# Altium schematic sheet USB.SchDoc
size A4
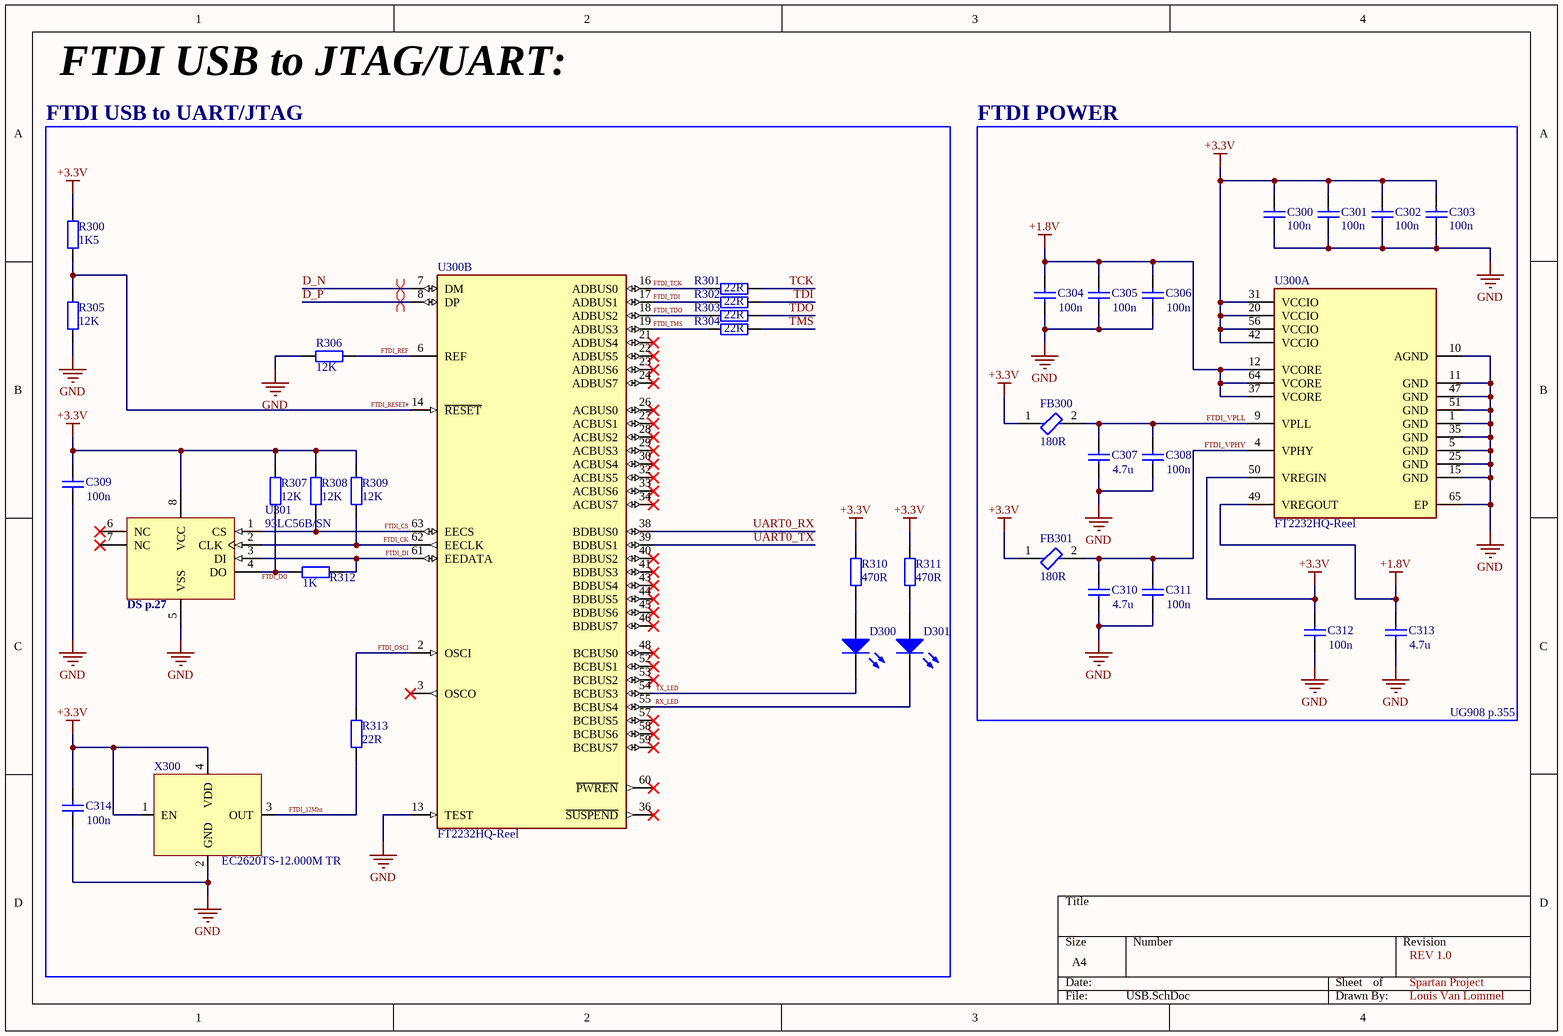
[diagram p0: USB.SchDoc]

## Parts
C300  100n  [CAP_0603]
C301  100n  [CAP_0603]
C302  100n  [CAP_0603]
C303  100n  [CAP_0603]
C304  100n  [CAP_0603]
C305  100n  [CAP_0603]
C306  100n  [CAP_0603]
C307  4.7u  [CAP_0603]
C308  100n  [CAP_0603]
C309  100n  [CAP_0603]
C310  4.7u  [CAP_0603]
C311  100n  [CAP_0603]
C312  100n  [CAP_0603]
C313  4.7u  [CAP_0603]
C314  100n  [CAP_0603]
D300  LED  [LED_0603]  (value not drawn)
D301  LED  [LED_0603]  (value not drawn)
FB300  180R  [CAP_0805]
FB301  180R  [CAP_0805]
R300  1K5  [RES_0603]
R301  value 22R  [RES_0603]  (hidden comment: 22)
R302  value 22R  [RES_0603]  (hidden comment: 22)
R303  value 22R  [RES_0603]  (hidden comment: 22)
R304  value 22R  [RES_0603]  (hidden comment: 22)
R305  12K  [RES_0603]
R306  12K  [RES_0603]
R307  12K  [RES_0603]
R308  12K  [RES_0603]
R309  12K  [RES_0603]
R310  value 470R  [RES_0603]  (hidden comment: 470)
R311  value 470R  [RES_0603]  (hidden comment: 470)
R312  1K  [RES_0603]
R313  value 22R  [RES_0603]  (hidden comment: 22)
U300  FT2232HQ-Reel  [FP-FT2232HQ-Reel-MFG]  (parts A,B of 2)
U301  93LC56B/SN  [SOIC8]
X300  EC2620TS-12.000M TR  [7x5mm Crystal]

## Blocks framed on the sheet
FTDI USB to UART/JTAG: C309 C314 D300 D301 R300-R313 U300 U301 X300
FTDI POWER: C300-C308 C310-C313 FB300 FB301 U300

## Nets
+1.8V: C304.2 C305.2 C306.2 C313.2 U300.12(VCORE) U300.37(VCORE) U300.49(VREGOUT) U300.64(VCORE)
+3.3V: C300.2 C301.2 C302.2 C303.2 C309.2 C312.2 C314.2 FB300.1 FB301.1 R300.2 R307.1 R308.1 R309.1 R310.2 R311.2 U300.20(VCCIO) U300.31(VCCIO) U300.42(VCCIO) U300.50(VREGIN) U300.56(VCCIO) U301.8(VCC) X300.1(EN) X300.4(VDD)
GND: C300.1 C301.1 C302.1 C303.1 C304.1 C305.1 C306.1 C307.1 C308.1 C309.1 C310.1 C311.1 C312.1 C313.1 C314.1 R305.1 R306.1 U300.1(GND) U300.5(GND) U300.10(AGND) U300.11(GND) U300.13(TEST) U300.15(GND) U300.25(GND) U300.35(GND) U300.47(GND) U300.51(GND) U300.65(EP) U301.5(VSS) X300.2(GND)
D_N: U300.7(DM)
D_P: U300.8(DP)
FTDI_12Mhz: R313.2 X300.3(OUT)
FTDI_CK: R309.2 U300.62(EECLK) U301.2(CLK)
FTDI_CS: R308.2 U300.63(EECS) U301.1(CS)
FTDI_DI: R312.1 U300.61(EEDATA) U301.3(DI)
FTDI_DO: R307.2 R312.2 U301.4(DO)
FTDI_OSCI: R313.1 U300.2(OSCI)
FTDI_REF: R306.2 U300.6(REF)
FTDI_RESET#: R300.1 R305.2 U300.14(~{RESET})
FTDI_TCK: R301.2 U300.16(ADBUS0)
FTDI_TDI: R302.2 U300.17(ADBUS1)
FTDI_TDO: R303.2 U300.18(ADBUS2)
FTDI_TMS: R304.2 U300.19(ADBUS3)
FTDI_VPHY: C310.2 C311.2 FB301.2 U300.4(VPHY)
FTDI_VPLL: C307.2 C308.2 FB300.2 U300.9(VPLL)
RX_LED: D301.2(K) U300.55(BCBUS4)
TCK: R301.1
TDI: R302.1
TDO: R303.1
TMS: R304.1
TX_LED: D300.2(K) U300.54(BCBUS3)
UART0_RX: U300.38(BDBUS0)
UART0_TX: U300.39(BDBUS1)
NetD300_1: D300.1(A) R310.1
NetD301_1: D301.1(A) R311.1

Not connected (* = marked no-connect by the designer): U300 3(OSCO)* 21(ADBUS4)* 22(ADBUS5)* 23(ADBUS6)* 24(ADBUS7)* 26(ACBUS0)* 27(ACBUS1)* 28(ACBUS2)* 29(ACBUS3)* 30(ACBUS4)* 32(ACBUS5)* 33(ACBUS6)* 34(ACBUS7)* 36(~{SUSPEND})* 40(BDBUS2)* 41(BDBUS3)* 43(BDBUS4)* 44(BDBUS5)* 45(BDBUS6)* 46(BDBUS7)* 48(BCBUS0)* 52(BCBUS1)* 53(BCBUS2)* 57(BCBUS5)* 58(BCBUS6)* 59(BCBUS7)* 60(~{PWREN})*; U301 6(NC)* 7(NC)*

## Layout directives
differential pair: D_N, D_P

## Notes on the sheet
- FTDI USB to JTAG/UART:
- (near U301) DS p.27
- UG908 p.355
- REV 1.0
- Spartan Project
- Louis Van Lommel

## Library data of the parts
C300-C314 = Cap: Capacitor; Published: 8-Jun-2000; LatestRevisionDate: 17-Jul-2002; LatestRevisionNote: Re-released for DXP Platform.; PackageReference: RAD-0.3; Publisher: Altium Limited; PackageDescription: Radial Cap, Thru-Hole; 2 Leads; 0.3 in Pin Spacing
  C300-C306 C308 C309 C311 C312 C314: Value: 100n
  C307 C310 C313: Value: 4.7u
D300 D301 = LED0: Typical INFRARED GaAs LED; Published: 8-Jun-2000; LatestRevisionDate: 08-Jul-2005; LatestRevisionNote: Mech Layer 1 removed.; PackageReference: LED-0; Publisher: Altium Limited; PackageDescription: LED; 2 Leads
FB300 FB301 = Ferrite Bead: Chip Ferrite Bead, 0402, 1000Ω @ 100MHz, 0.65Ω, 25%, 300mA; DC Current: 200mA; Number of Circuits: 1; Shielding: Unshielded; Impedance: 1kR; DC Resistance (DCR): 650mR; DC Resistance-Max: 1R; Packaging: Tape and Reel; Case Code (Imperial): 0402; Military Standard: Not; Min Operating Temperature: -55°C; Width: 0.5mm; Tolerance: 25%; Material: Ferrite; Number of Lines: 1; Max Current Rating: 300mA; Depth: 0.55mm; Package Quantity: 1; Case/Package: 0402; Series: BLM15AG_SN; Case Code (Metric): 1005; Max Operating Temperature: 125°C; Lead Free: Lead Free; Test Frequency: 100MHz; RoHS Compliant: Yes; Radiation Hardening: No; Number of Pins: 2; Core Material: Ferrite; Current Rating: 300mA; Frequency: 100MHz; Max DC Current: 200mA; REACH SVHC: No SVHC; Length: 1mm; Termination: SMD/SMT; Height: 0.5mm
R300-R313 = Res2: Resistor; Published: 8-Jun-2000; LatestRevisionDate: 17-Jul-2002; LatestRevisionNote: Re-released for DXP Platform.; PackageReference: AXIAL-0.4; Publisher: Altium Limited; PackageDescription: Axial Device, Thru-Hole; 2 Leads; 0.4 in Pin Spacing
  R300: Value: 1K5
  R305-R309: Value: 12K
  R312: Value: 1K
U300 = CMP-0078-00004-5: IC USB HS DUAL UART/FIFO 64-QFN; Manufacturer: FTDI; Min Supply Voltage: 1.62V; Ciiva Ids: 1315829; Nominal Supply Current: 5-70mA; Standoff Height: 0mm; Import Ts: 1521843541; Number Of Ports: 1; Max Supply Voltage: 3.63V; Data Rate: 480Mbits/s; Interface: I2C,SPI,UART,USB,RS-232,RS-485,RS-422,Other; Usb Standard: USB 2.0; Octopart: https://octopart.com/ft2232hq-reel-ftdi-19172126; Ipc Land Pattern Name: QFN50P900X900X85-64; Ambient Temperature Range High: +85°C; RoHS: TRUE; Manufacturer Part Number: FT2232HQ-Reel; Automotive: No; Footprint Url: https://www.ftdichip.com/Support/Documents/TechnicalNotes/TN_166%20FTDI%20Example%20IC%20PCB%20Footprints.pdf; Temperature Range High: +85°C; ComponentLink2Description: Datasheet; Ambient Temperature Range Low: -40°C; Mouser Description: USB Interface IC USB HS to Dual UART/ FIFO/SPI/JTAG/I2C; ComponentLink2URL: https://www.ftdichip.com/Support/Documents/DataSheets/ICs/DS_FT2232H.pdf; Digikey Description: IC USB HS DUAL UART/FIFO 64-QFN; Release Date: 1383921489; Height: 0.9mm; Lead Free: Yes; Package: QFN64; Device Class L1: Integrated Circuits (ICs); Temperature: -40°C to +85°C; Temperature Range Low: -40°C; Category: IC; Device Class L2: Interface ICs; Device Class L3: USB Interface ICs
U301 = MEM-SEEPROM-93AA46B-P-8: 2K, 128x16-bit, 2.5V Microwire Serial EEPROM, 8-Pin SOIC 150mil, Commercial Temperature; DatasheetVersion: revF, May-2008; PackageVersion: revBB, Aug-2009; PackageReference: SOIC-SN8; PackageDescription: 8-Lead Plastic Small Outline (SN) - Narrow, 3.90mm Body [SOIC]; Code_IPC: SOIC127P600-8; Code_JEDEC: MS-012
X300 = Oscillator: 12Mhz oscillator